# Altium schematic sheet schematic_final_wish.SchDoc
size A4
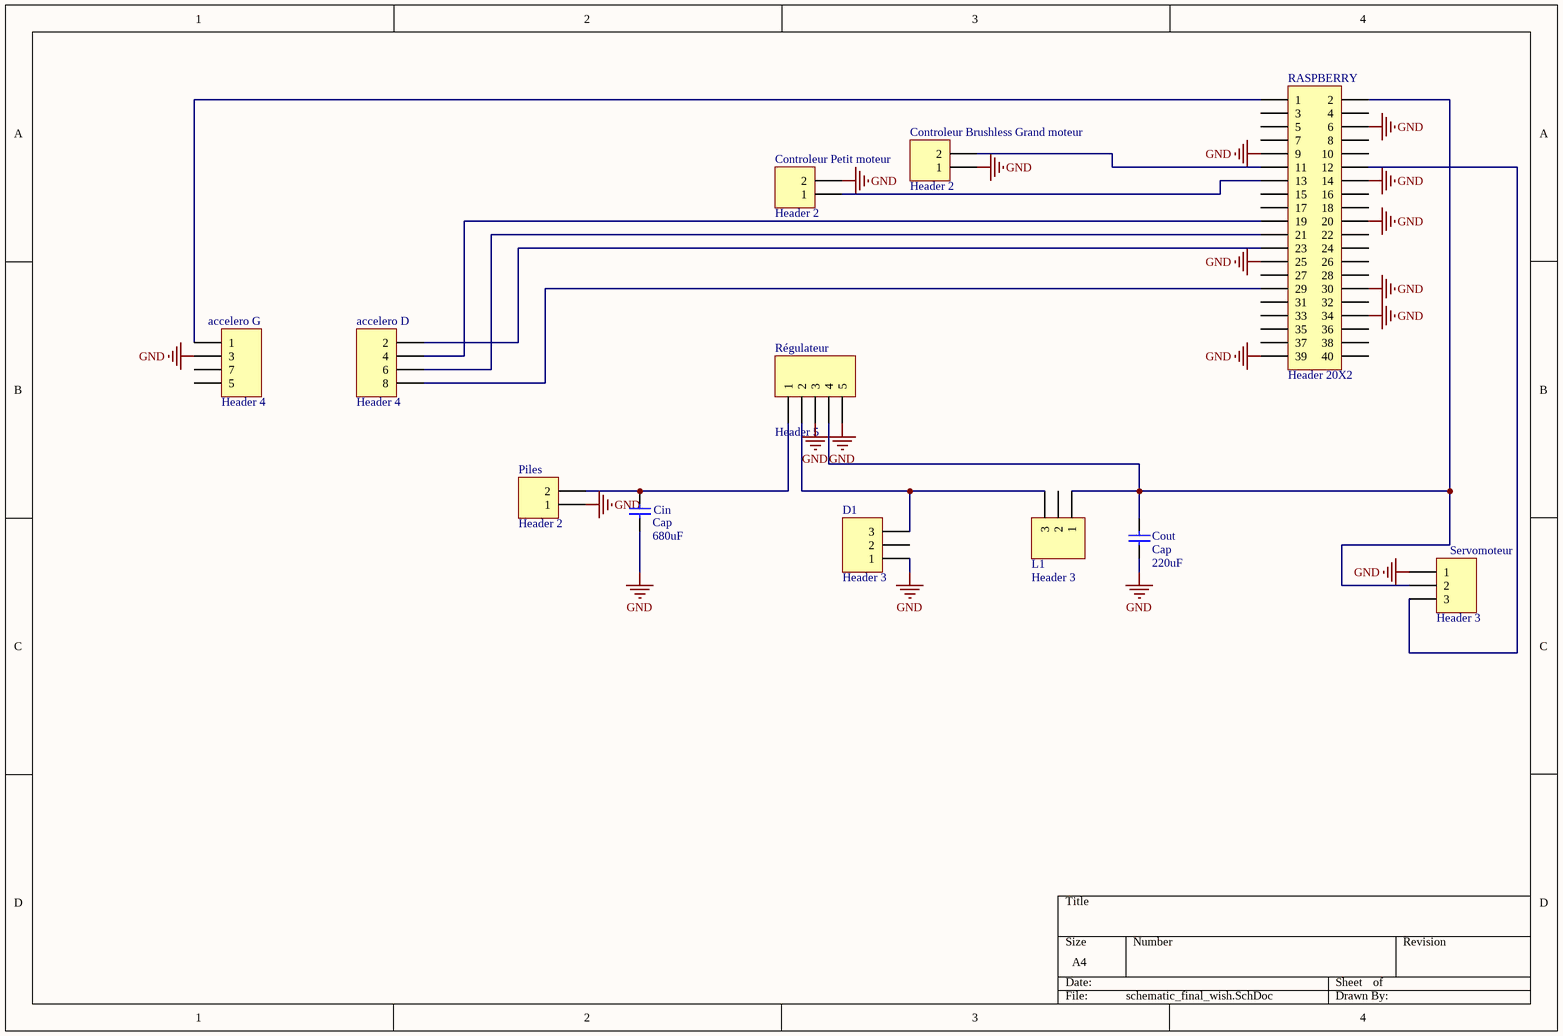
[diagram p0: schematic_final_wish.SchDoc]

## Parts
accelero_D  Header 4  [HDR1X4]
accelero_G  Header 4  [HDR1X4]
Cin  Cap  value 680uF  [RAD-0.3]
Controleur_Brushless_Grand_moteur  Header 2  [HDR1X2]
Controleur_Petit_moteur  Header 2  [HDR1X2]
Cout  Cap  value 220uF  [RAD-0.3]
D1  Header 3  [HDR1X3]
L1  Header 3  [HDR1X3]
Piles  Header 2  [HDR1X2]
RASPBERRY  Header 20X2  [HDR2X20]
Régulateur  Header 5  [HDR1X5]
Servomoteur  Header 3  [HDR1X3]

## Nets
GND: accelero_G.3 Cin.2 Controleur_Brushless_Grand_moteur.1 Controleur_Petit_moteur.2 Cout.2 D1.1 Piles.1 RASPBERRY.6 RASPBERRY.9 RASPBERRY.14 RASPBERRY.20 RASPBERRY.25 RASPBERRY.30 RASPBERRY.34 RASPBERRY.39 Régulateur.3 Régulateur.5 Servomoteur.1
Netaccelero_D_2: accelero_D.2 RASPBERRY.23
Netaccelero_D_4: accelero_D.4 RASPBERRY.19
Netaccelero_D_6: accelero_D.6 RASPBERRY.21
Netaccelero_D_8: accelero_D.8 RASPBERRY.29
Netaccelero_G_1: accelero_G.1 RASPBERRY.1
NetCin_1: Cin.1 Piles.2 Régulateur.1
NetControleur_Brushless_Grand_moteur_2: Controleur_Brushless_Grand_moteur.2 RASPBERRY.11
NetControleur_Petit_moteur_1: Controleur_Petit_moteur.1 RASPBERRY.13
NetCout_1: Cout.1 L1.1 RASPBERRY.2 Régulateur.4 Servomoteur.2
NetD1_3: D1.3 L1.3 Régulateur.2
NetRASPBERRY_12: RASPBERRY.12 Servomoteur.3

Not connected (* = marked no-connect by the designer): accelero_G 5 7; D1 2; L1 2; RASPBERRY 3 4 5 7 8 10 15 16 17 18 22 24 26 27 28 31 32 33 35 36 37 38 40

## Library data of the parts
accelero_D accelero_G = Header 4: Header, 4-Pin; LatestRevisionDate: 17-Jul-2002; LatestRevisionNote: Re-released for DXP Platform.; Publisher: Altium Limited
Cin Cout = Cap: Capacitor; Published: 8-Jun-2000; LatestRevisionDate: 17-Jul-2002; LatestRevisionNote: Re-released for DXP Platform.; PackageReference: RAD-0.3; Publisher: Altium Limited; PackageDescription: Radial Cap, Thru-Hole; 2 Leads; 0.3 in Pin Spacing
Controleur_Brushless_Grand_moteur Controleur_Petit_moteur Piles = Header 2: Header, 2-Pin; LatestRevisionDate: 17-Jul-2002; LatestRevisionNote: Re-released for DXP Platform.; Publisher: Altium Limited
D1 L1 Servomoteur = Header 3: Header, 3-Pin; LatestRevisionDate: 17-Jul-2002; LatestRevisionNote: Re-released for DXP Platform.; Publisher: Altium Limited
RASPBERRY = Header 20X2: Header, 20-Pin, Dual row; LatestRevisionDate: 17-Jul-2002; LatestRevisionNote: Re-released for DXP Platform.; Publisher: Altium Limited
Régulateur = Header 5: Header, 5-Pin; LatestRevisionDate: 17-Jul-2002; LatestRevisionNote: Re-released for DXP Platform.; Publisher: Altium Limited